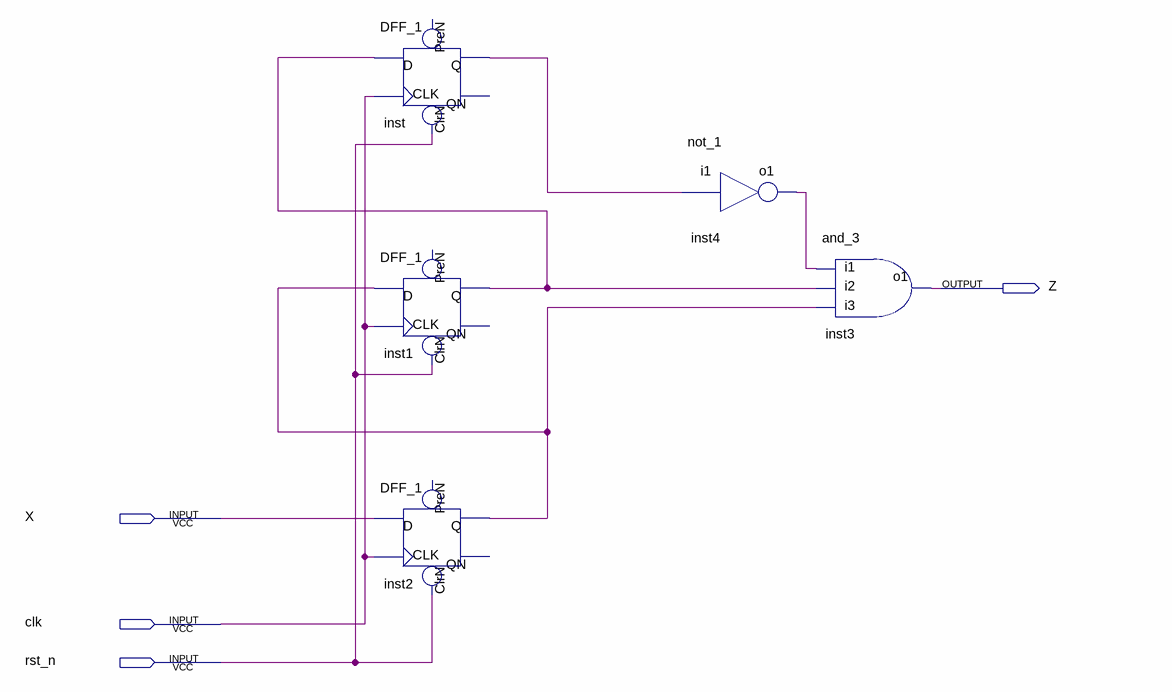
[diagram p0: schematic sheet]
// Quartus schematic SD.bdf as structural Verilog: 5 symbols, 4 pins
module SD (
  input  X,
  input  clk,
  input  rst_n,
  output Z
);

  wire inst1_q, inst2_q, inst4_o1, inst_q;

  DFF_1 inst (.CLK(clk), .D(inst1_q), .ClrN(rst_n), .Q(inst_q));  // open: PreN, QN
  DFF_1 inst1 (.CLK(clk), .D(inst2_q), .ClrN(rst_n), .Q(inst1_q));  // open: PreN, QN
  DFF_1 inst2 (.CLK(clk), .D(X), .ClrN(rst_n), .Q(inst2_q));  // open: PreN, QN
  not_1 inst4 (.i1(inst_q), .o1(inst4_o1));
  and_3 inst3 (.i1(inst4_o1), .i2(inst1_q), .i3(inst2_q), .o1(Z));
endmodule
